# Altium project Orion_L1_SmashBoy.PrjPcb
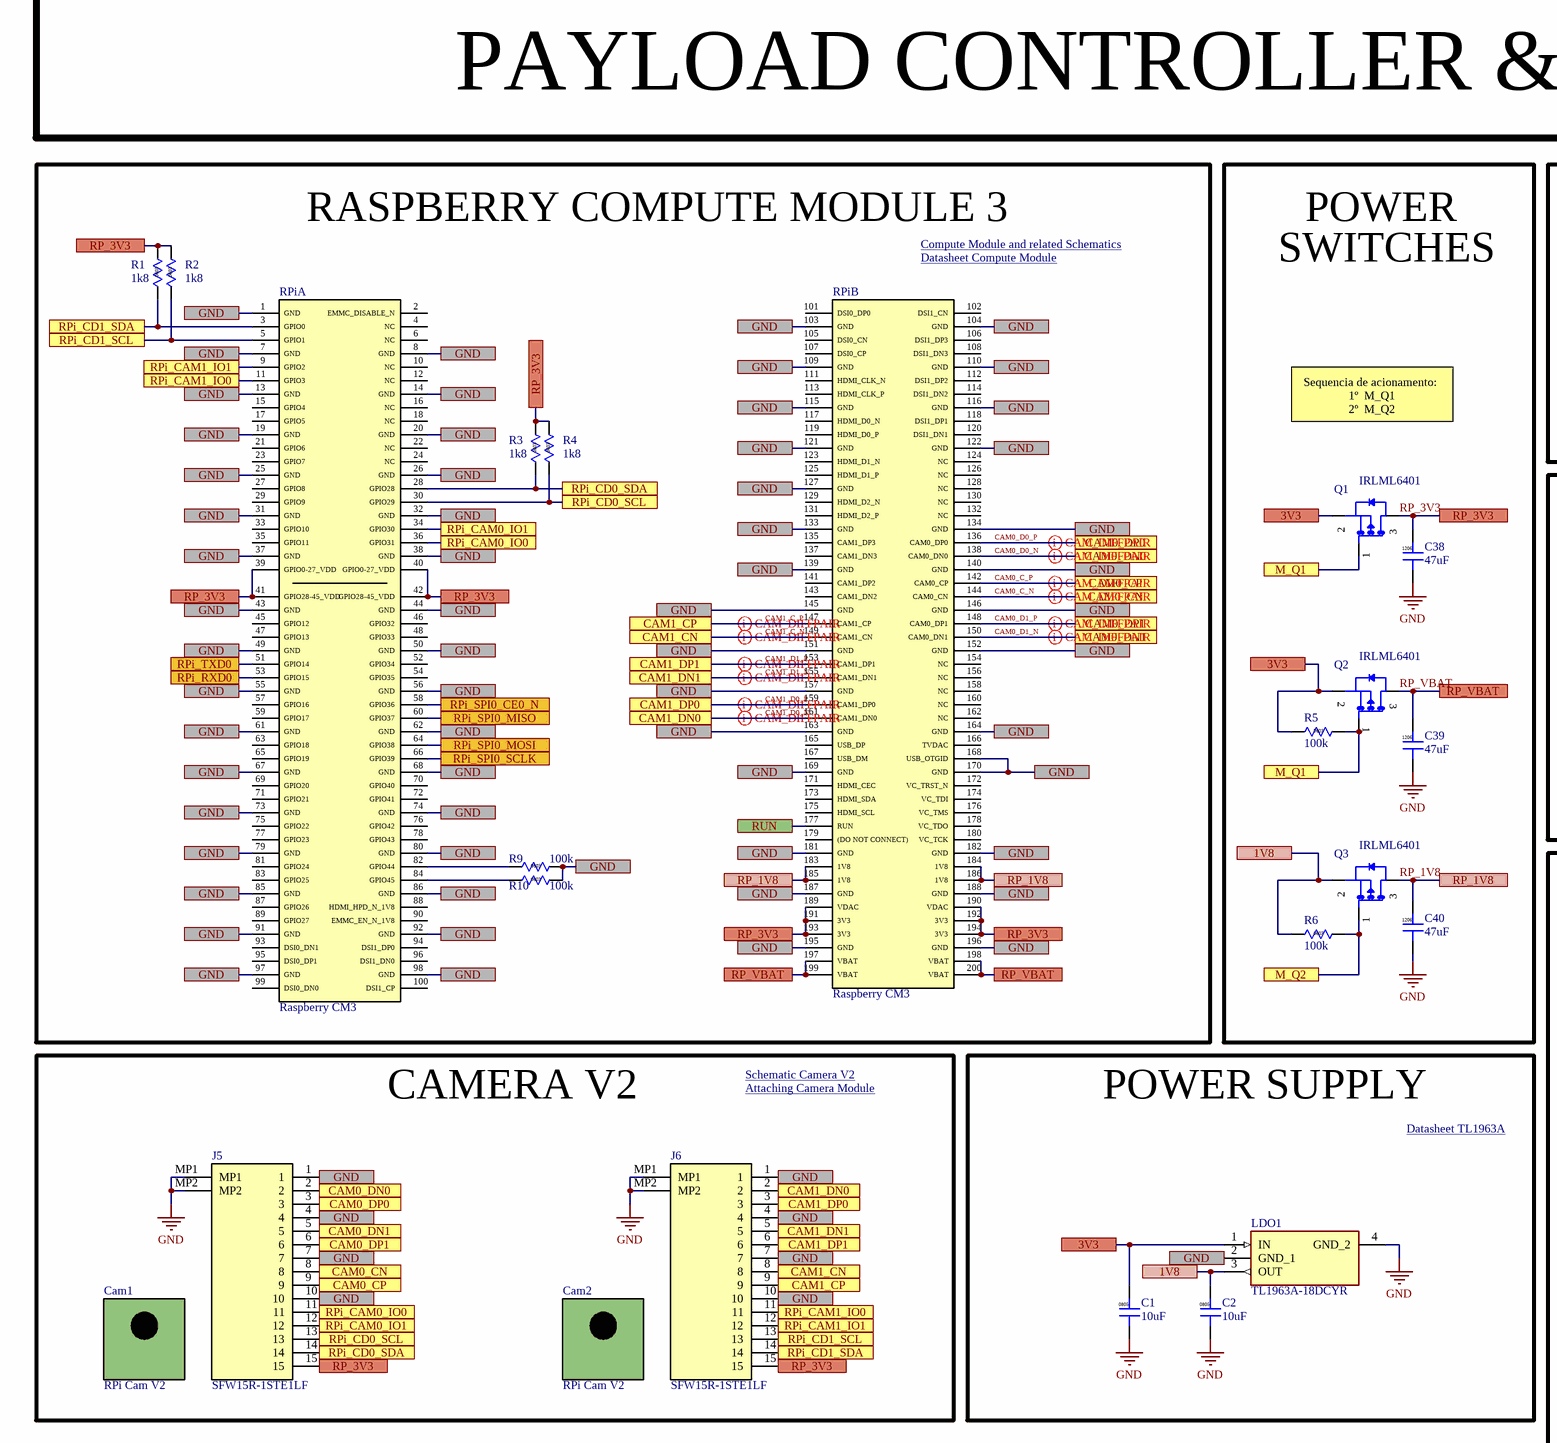
[diagram p0: L1_Smashboy_Sheet1.SchDoc, top left]
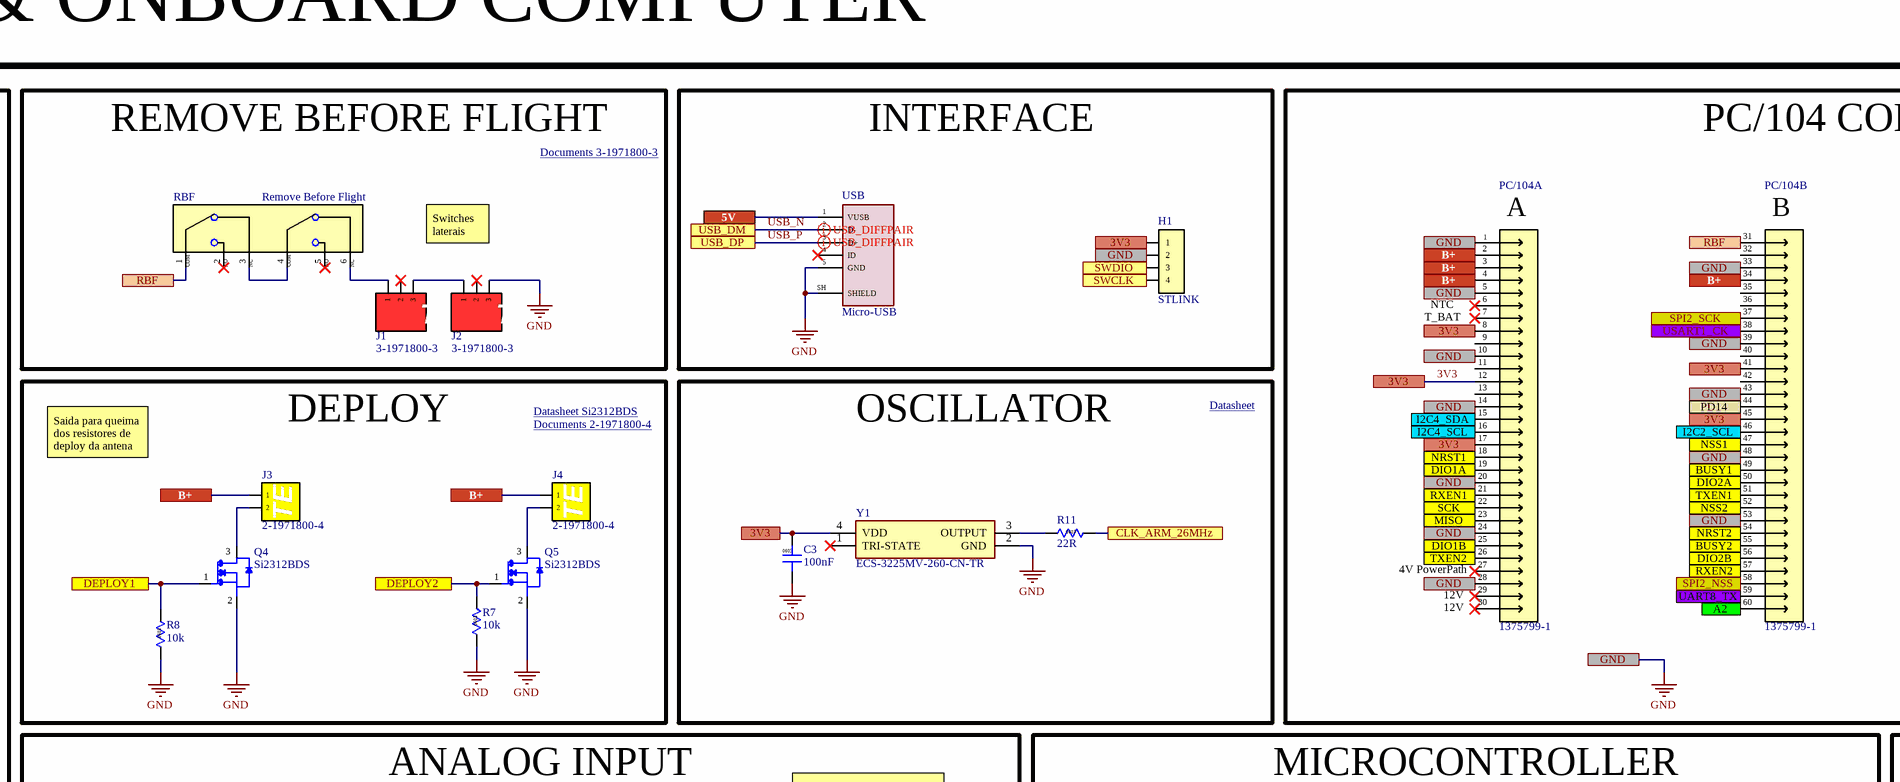
[diagram p1: L1_Smashboy_Sheet1.SchDoc, top middle]
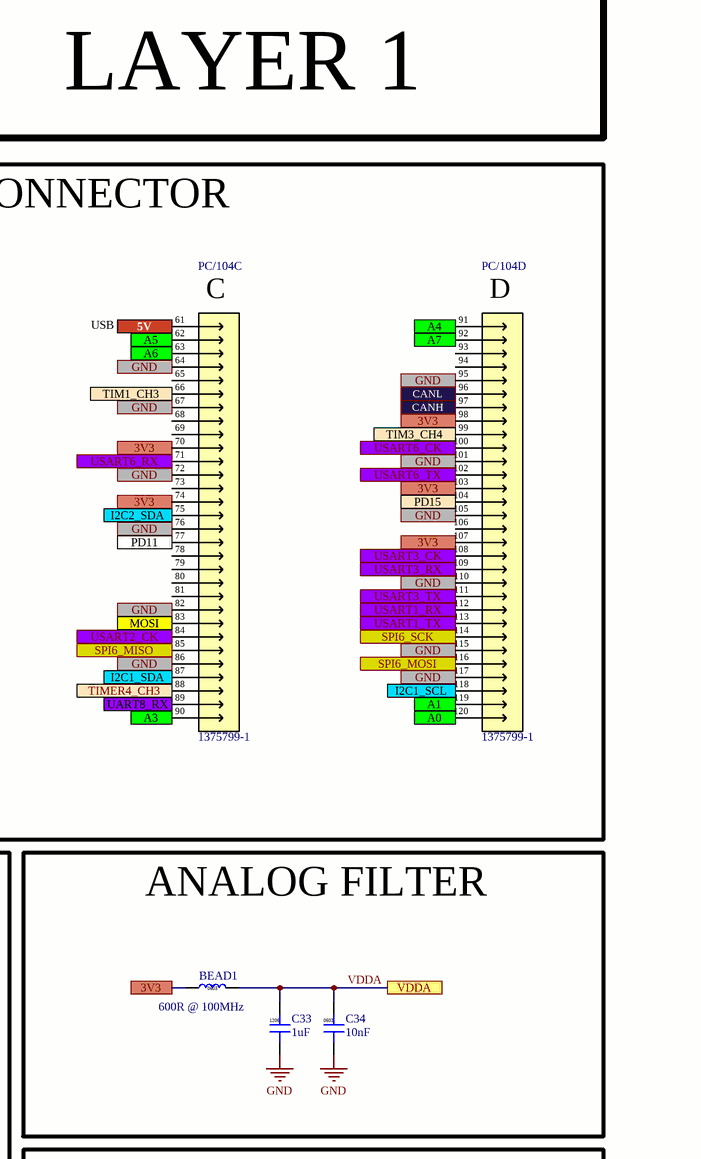
[diagram p2: L1_Smashboy_Sheet1.SchDoc, top right]
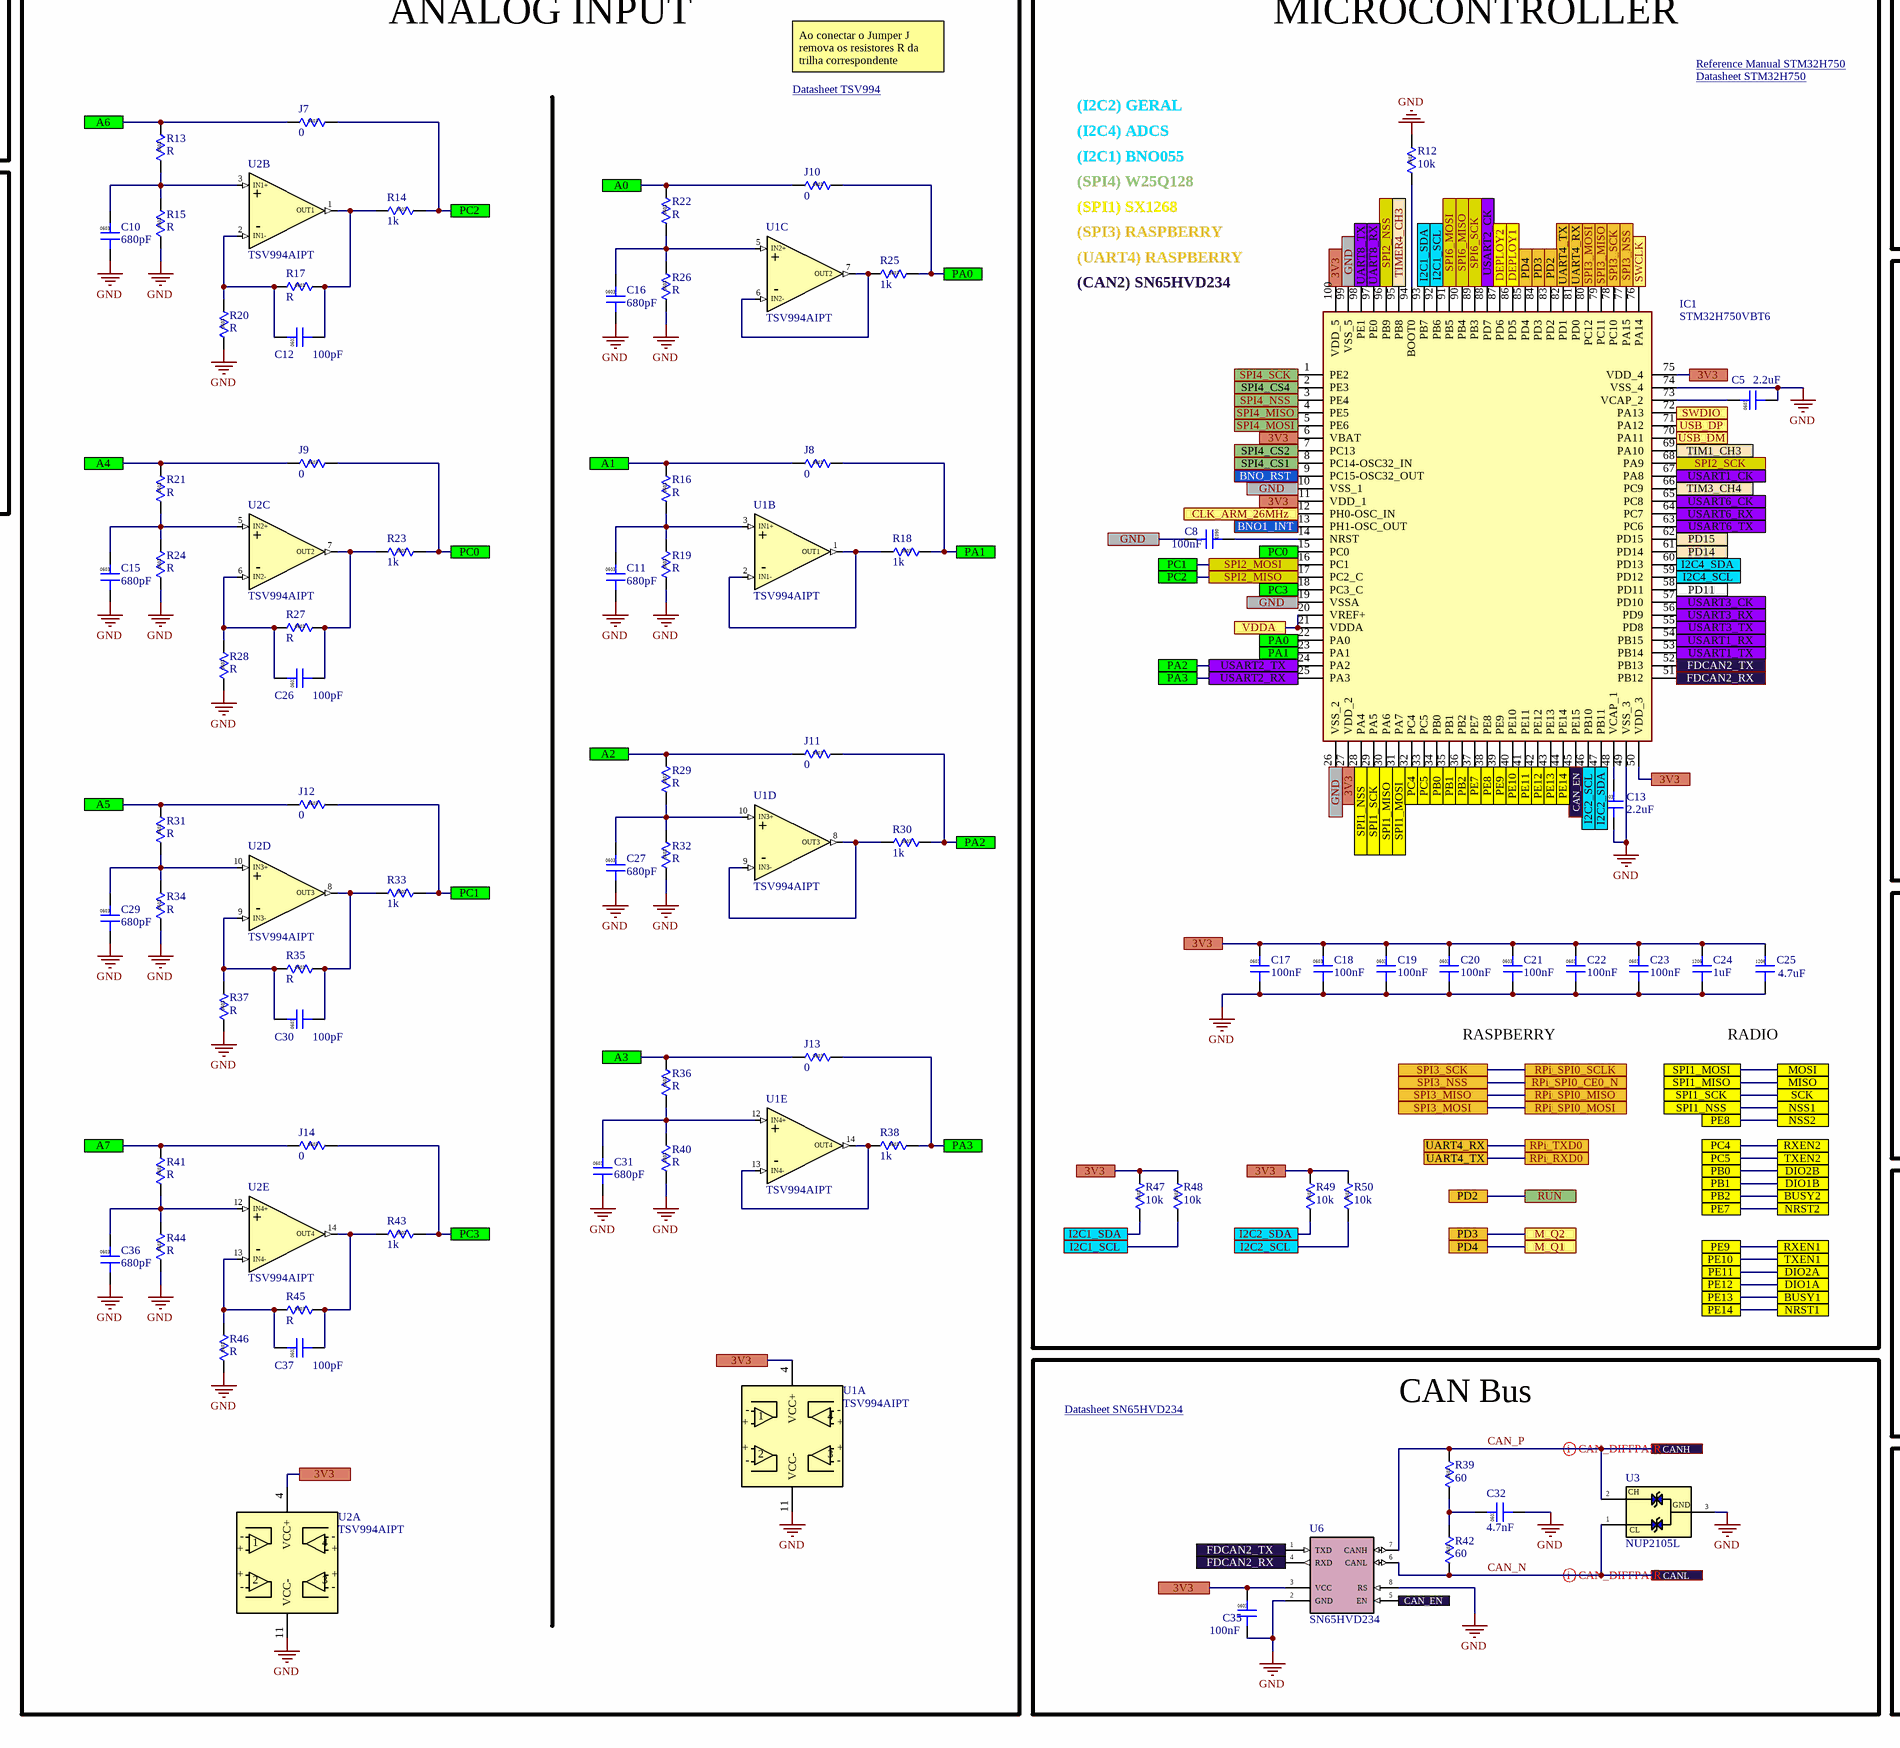
[diagram p3: L1_Smashboy_Sheet1.SchDoc, bottom middle]
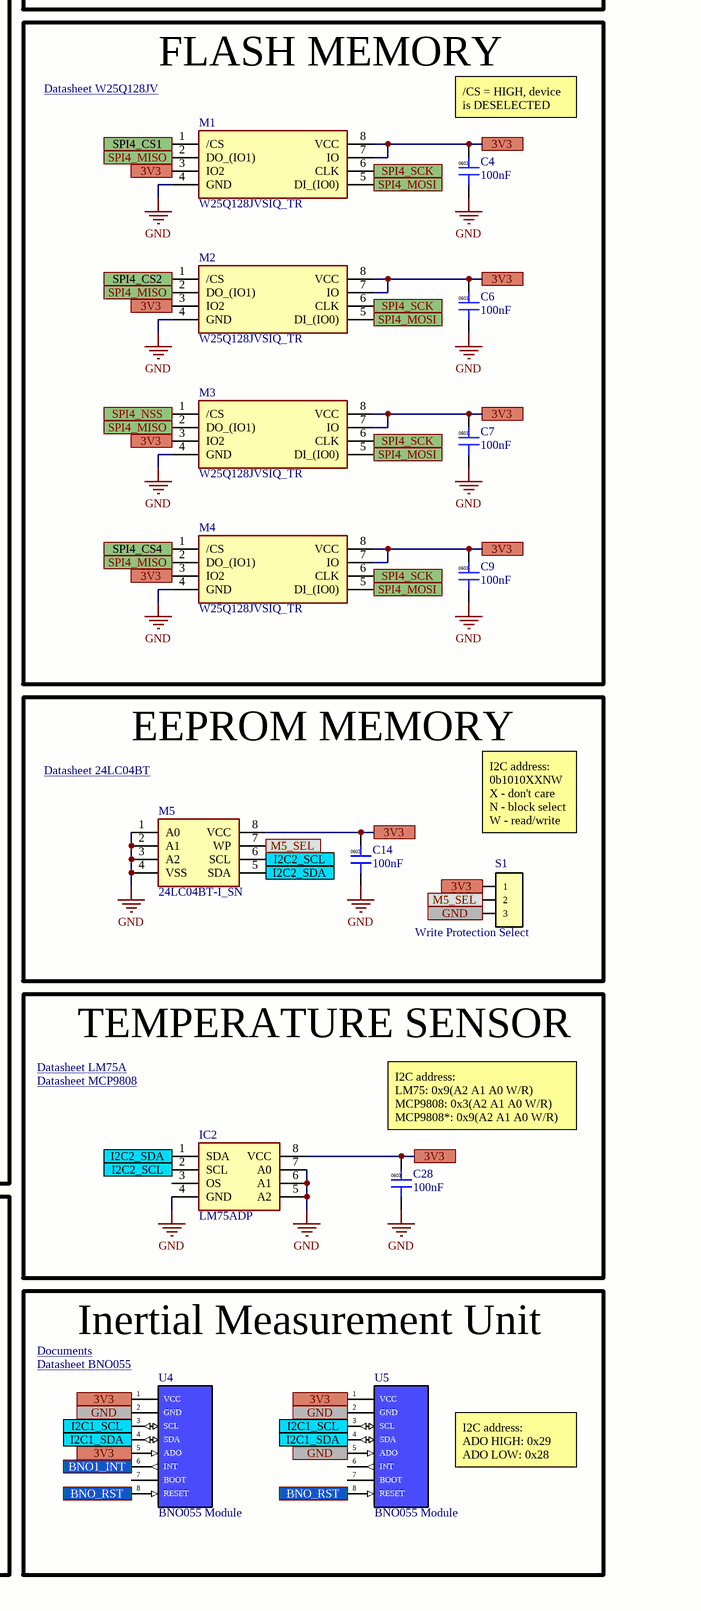
[diagram p4: L1_Smashboy_Sheet1.SchDoc, bottom right]
1 sheet, 133 parts. Net scope: flat (ports and power ports of the same name join across sheets).
Board file: L1_SmashBoy_PCB2.PcbDoc

## Sheet L1_Smashboy_Sheet1.SchDoc
size A1; SheetNumber: 1; SheetTotal: 1

### Parts
BEAD1  600R @ 100MHz  [IND0603]
C1  10uF  [CAP0805_085]
C2  10uF  [CAP0805_085]
C3  100nF  [CAP0603_060]
C4  100nF  [CAP0603_060]
C5  2.2uF  [CAP0603_060]
C6  100nF  [CAP0603_060]
C7  100nF  [CAP0603_060]
C8  100nF  [CAP0603_060]
C9  100nF  [CAP0603_060]
C10  680pF  [CAP0603_060]
C11  680pF  [CAP0603_060]
C12  100pF  [CAP0603_060]
C13  2.2uF  [CAP0603_060]
C14  100nF  [CAP0603_060]
C15  680pF  [CAP0603_060]
C16  680pF  [CAP0603_060]
C17  100nF  [CAP0603_060]
C18  100nF  [CAP0603_060]
C19  100nF  [CAP0603_060]
C20  100nF  [CAP0603_060]
C21  100nF  [CAP0603_060]
C22  100nF  [CAP0603_060]
C23  100nF  [CAP0603_060]
C24  1uF  [CAP1206_090]
C25  4.7uF  [CAP1206_090]
C26  100pF  [CAP0603_060]
C27  680pF  [CAP0603_060]
C28  100nF  [CAP0603_060]
C29  680pF  [CAP0603_060]
C30  100pF  [CAP0603_060]
C31  680pF  [CAP0603_060]
C32  4.7nF  [CAP0603_060]
C33  1uF  [CAP1206_090]
C34  10nF  [CAP0603_060]
C35  100nF  [CAP0603_060]
C36  680pF  [CAP0603_060]
C37  100pF  [CAP0603_060]
C38  47uF  [CAP1206_090]
C39  47uF  [CAP1206_090]
C40  47uF  [CAP1206_090]
Cam1  RPi Cam V2  [RPi_CAM_V2]
Cam2  RPi Cam V2  [RPi_CAM_V2]
H1  STLINK  [Header-4P-90]
IC1  STM32H750VBT6  [QFP50P1600X1600X160-100N]
IC2  LM75ADP  [SOP65P490X110-8N]
J1  3-1971800-3  [3-1971800-3]
J2  3-1971800-3  [3-1971800-3]
J3  2-1971800-4  [2-1971800-4]
J4  2-1971800-4  [2-1971800-4]
J5  SFW15R-1STE1LF  [SFW15R1STE1LF]
J6  SFW15R-1STE1LF  [SFW15R1STE1LF]
J7  0  [RES0603]
J8  0  [RES0603]
J9  0  [RES0603]
J10  0  [RES0603]
J11  0  [RES0603]
J12  0  [RES0603]
J13  0  [RES0603]
J14  0  [RES0603]
LDO1  TL1963A-18DCYR  [SOT230P700X180-4N]
M1  W25Q128JVSIQ_TR  [SOIC127P780X195-8N]
M2  W25Q128JVSIQ_TR  [SOIC127P780X195-8N]
M3  W25Q128JVSIQ_TR  [SOIC127P780X195-8N]
M4  W25Q128JVSIQ_TR  [SOIC127P780X195-8N]
M5  24LC04BT-I_SN  [SOIC127P600X175-8N]
PC/104  1375799-1  [1375799-1]  (parts A,B,C,D of 4)
Q1  IRLML6401  [SOT-23]
Q2  IRLML6401  [SOT-23]
Q3  IRLML6401  [SOT-23]
Q4  Si2312BDS  [SOT-23]
Q5  Si2312BDS  [SOT-23]
R1  1k8  [RES0603]
R2  1k8  [RES0603]
R3  1k8  [RES0603]
R4  1k8  [RES0603]
R5  100k  [RES0603]
R6  100k  [RES0603]
R7  10k  [RES0603]
R8  10k  [RES0603]
R9  100k  [RES0603]
R10  100k  [RES0603]
R11  22R  [RES0603]
R12  10k  [RES0603]
R13  R  [RES0603]
R14  1k  [RES0603]
R15  R  [RES0603]
R16  R  [RES0603]
R17  R  [RES0603]
R18  1k  [RES0603]
R19  R  [RES0603]
R20  R  [RES0603]
R21  R  [RES0603]
R22  R  [RES0603]
R23  1k  [RES0603]
R24  R  [RES0603]
R25  1k  [RES0603]
R26  R  [RES0603]
R27  R  [RES0603]
R28  R  [RES0603]
R29  R  [RES0603]
R30  1k  [RES0603]
R31  R  [RES0603]
R32  R  [RES0603]
R33  1k  [RES0603]
R34  R  [RES0603]
R35  R  [RES0603]
R36  R  [RES0603]
R37  R  [RES0603]
R38  1k  [RES0603]
R39  60  [RES0603]
R40  R  [RES0603]
R41  R  [RES0603]
R42  60  [RES0603]
R43  1k  [RES0603]
R44  R  [RES0603]
R45  R  [RES0603]
R46  R  [RES0603]
R47  10k  [RES0603]
R48  10k  [RES0603]
R49  10k  [RES0603]
R50  10k  [RES0603]
RBF  Remove Before Flight  [RBF]
RPi  Raspberry CM3  [RPi-CM3]  (parts A,B of 2)
S1  Write Protection Select  [Header-3P]
U1  TSV994AIPT  [SOP65P640X120-14N]  (parts A,B,C,D,E of 5)
U2  TSV994AIPT  [SOP65P640X120-14N]  (parts A,B,C,D,E of 5)
U3  NUP2105L  [SOT-23]
U4  BNO055 Module  [BNO055_M_TH]
U5  BNO055 Module  [BNO055_M_TH]
U6  SN65HVD234  [SOIC-8]
USB  Micro-USB  [MicroUSB]
Y1  ECS-3225MV-260-CN-TR  [ECS3225MVQ250CNTR]

### Blocks framed on the sheet
RASPBERRY COMPUTE MODULE 3: R1-R4 R9 R10 RPi
REMOVE BEFORE FLIGHT: J1 J2 RBF
INTERFACE: H1 USB
PC/104 CONNECTOR: PC/104
DEPLOY: J3 J4 Q4 Q5 R7 R8
OSCILLATOR: C3 R11 Y1
ANALOG INPUT: C10-C12 C15 C16 C26 C27 C29-C31 C36 C37 J7-J14 R13-R38 R40 R41 R43-R46 U1 U2
MICROCONTROLLER: C5 C8 C13 C17-C25 IC1 R12 R47-R50
ANALOG FILTER: BEAD1 C33 C34
CAMERA V2: Cam1 Cam2 J5 J6
POWER SUPPLY: C1 C2 LDO1
FLASH MEMORY: C4 C6 C7 C9 M1-M4
EEPROM MEMORY: C14 M5 S1
TEMPERATURE SENSOR: C28 IC2
CAN Bus: C32 C35 R39 R42 U3 U6
Inertial Measurement Unit: U4 U5

### Ports
1V8, 3V3, 5V, A0, A1, A2, A3, A4, A5, A6, A7, B+, BNO1_INT, BNO_RST, BUSY1, BUSY2, CAM0_CN, CAM0_CP, CAM0_DN0, CAM0_DN1, CAM0_DP0, CAM0_DP1, CAM1_CN, CAM1_CP, CAM1_DN0, CAM1_DN1, CAM1_DP0, CAM1_DP1, CAN_EN, CANH, CANL, CLK_ARM_26MHz, DEPLOY1, DEPLOY2, DIO1A, DIO1B, DIO2A, DIO2B, FDCAN2_RX, FDCAN2_TX, GND, I2C1_SCL, I2C1_SDA, I2C2_SCL, I2C2_SDA, I2C4_SCL, I2C4_SDA, M5_SEL, M_Q1, M_Q2, MISO, MOSI, NRST1, NRST2, NSS1, NSS2, PA0, PA1, PA2, PA3, PB0, PB1, PB2, PC0, PC1, PC2, PC3, PC4, PC5, PD2, PD3, PD4, PD11, PD14, PD15, PE7, PE8, PE9, PE10, PE11, PE12, PE13, PE14, RBF, RP_1V8, RP_3V3, RP_VBAT, RPi_CAM0_IO0, RPi_CAM0_IO1, RPi_CAM1_IO0, RPi_CAM1_IO1, RPi_CD0_SCL, RPi_CD0_SDA, RPi_CD1_SCL, RPi_CD1_SDA, RPi_RXD0, RPi_SPI0_CE0_N, RPi_SPI0_MISO, RPi_SPI0_MOSI, RPi_SPI0_SCLK, RPi_TXD0, RUN, RXEN1, RXEN2, SCK, SPI1_MISO, SPI1_MOSI, SPI1_NSS, SPI1_SCK, SPI2_MISO, SPI2_MOSI, SPI2_NSS, SPI2_SCK, SPI3_MISO, SPI3_MOSI, SPI3_NSS, SPI3_SCK, SPI4_CS1, SPI4_CS2, SPI4_CS4, SPI4_MISO, SPI4_MOSI, SPI4_NSS, SPI4_SCK, SPI6_MISO, SPI6_MOSI, SPI6_SCK, SWCLK, SWDIO, TIM1_CH3, TIM3_CH4, TIMER4_CH3, TXEN1, TXEN2, UART4_RX, UART4_TX, UART8_RX, UART8_TX, USART1_CK, USART1_RX, USART1_TX, USART2_CK, USART2_RX, USART2_TX, USART3_CK, USART3_RX, USART3_TX, USART6_CK, USART6_RX, USART6_TX, USB_DM, USB_DP, VDDA

### Nets
GND: C1.2 C2.2 C3.2 C4.2 C5.2 C6.2 C7.2 C8.2 C9.2 C10.2 C11.2 C13.2 C14.2 C15.2 C16.2 C17.2 C18.2 C19.2 C20.2 C21.2 C22.2 C23.2 C24.2 C25.2 C27.2 C28.2 C29.2 C31.2 C32.2 C33.2 C34.2 C35.2 C36.2 C38.2 C39.2 C40.2 H1.2 IC1.10(VSS_1) IC1.19(VSSA) IC1.26(VSS_2) IC1.49(VSS_3) IC1.74(VSS_4) IC1.99(VSS_5) IC2.4(GND) IC2.5(A2) IC2.6(A1) IC2.7(A0) J2.3 J5.1 J5.4 J5.7 J5.10 J5.MP1 J5.MP2 J6.1 J6.4 J6.7 J6.10 J6.MP1 J6.MP2 LDO1.2(GND_1) LDO1.4(GND_2) M1.4(GND) M2.4(GND) M3.4(GND) M4.4(GND) M5.1(A0) M5.2(A1) M5.3(A2) M5.4(VSS) PC/104.1 PC/104.5 PC/104.10 PC/104.14 PC/104.20 PC/104.24 PC/104.28 PC/104.33 PC/104.39 PC/104.43 PC/104.48 PC/104.53 PC/104.64 PC/104.67 PC/104.72 PC/104.76 PC/104.82 PC/104.86 PC/104.95 PC/104.101 PC/104.105 PC/104.110 PC/104.115 PC/104.117 Q4.2 Q5.2 R7.1 R8.1 R9.2 R10.2 R12.2 R15.1 R19.1 R20.1 R24.1 R26.1 R28.1 R32.1 R34.1 R37.1 R40.1 R44.1 R46.1 RPi.1(GND) RPi.7(GND) RPi.8(GND) RPi.13(GND) RPi.14(GND) RPi.19(GND) RPi.20(GND) RPi.25(GND) RPi.26(GND) RPi.31(GND) RPi.32(GND) RPi.37(GND) RPi.38(GND) RPi.43(GND) RPi.44(GND) RPi.49(GND) RPi.50(GND) RPi.55(GND) RPi.56(GND) RPi.61(GND) RPi.62(GND) RPi.67(GND) RPi.68(GND) RPi.73(GND) RPi.74(GND) RPi.79(GND) RPi.80(GND) RPi.85(GND) RPi.86(GND) RPi.91(GND) RPi.92(GND) RPi.97(GND) RPi.98(GND) RPi.103(GND) RPi.104(GND) RPi.109(GND) RPi.110(GND) RPi.115(GND) RPi.116(GND) RPi.121(GND) RPi.122(GND) RPi.127(GND) RPi.133(GND) RPi.134(GND) RPi.139(GND) RPi.140(GND) RPi.145(GND) RPi.146(GND) RPi.151(GND) RPi.152(GND) RPi.157(GND) RPi.163(GND) RPi.164(GND) RPi.168(USB_OTGID) RPi.169(GND) RPi.170(GND) RPi.181(GND) RPi.182(GND) RPi.187(GND) RPi.188(GND) RPi.195(GND) RPi.196(GND) S1.3 U1.11(VCC-) U2.11(VCC-) U3.3(GND) U4.2(GND) U5.2(GND) U5.5(ADO) U6.2(GND) U6.8(RS) USB.5(GND) USB.SH(SHIELD) Y1.2(GND) ; port GND
3V3: BEAD1.1 C1.1 C3.1 C4.1 C6.1 C7.1 C9.1 C14.1 C17.1 C18.1 C19.1 C20.1 C21.1 C22.1 C23.1 C24.1 C25.1 C28.1 C35.1 H1.1 IC1.6(VBAT) IC1.11(VDD_1) IC1.27(VDD_2) IC1.50(VDD_3) IC1.75(VDD_4) IC1.100(VDD_5) IC2.8(VCC) LDO1.1(IN) M1.3(IO2) M1.7(IO) M1.8(VCC) M2.3(IO2) M2.7(IO) M2.8(VCC) M3.3(IO2) M3.7(IO) M3.8(VCC) M4.3(IO2) M4.7(IO) M4.8(VCC) M5.8(VCC) PC/104.8 PC/104.12 PC/104.17 PC/104.41 PC/104.45 PC/104.70 PC/104.74 PC/104.98 PC/104.103 PC/104.107 Q1.2 Q2.2 R5.1 R47.2 R48.2 R49.2 R50.2 S1.1 U1.4(VCC+) U2.4(VCC+) U4.1(VCC) U4.5(ADO) U5.1(VCC) U6.3(VCC) Y1.4(VDD) ; port 3V3
CAM0_C_N: J5.8 RPi.144(CAM0_CN) ; port CAM0_CN
CAM0_C_P: J5.9 RPi.142(CAM0_CP) ; port CAM0_CP
CAM0_D0_N: J5.2 RPi.138(CAM0_DN0) ; port CAM0_DN0
CAM0_D0_P: J5.3 RPi.136(CAM0_DP0) ; port CAM0_DP0
CAM0_D1_N: J5.5 RPi.150(CAM0_DN1) ; port CAM0_DN1
CAM0_D1_P: J5.6 RPi.148(CAM0_DP1) ; port CAM0_DP1
CAM1_C_N: J6.8 RPi.149(CAM1_CN) ; port CAM1_CN
CAM1_C_P: J6.9 RPi.147(CAM1_CP) ; port CAM1_CP
CAM1_D0_N: J6.2 RPi.161(CAM1_DN0) ; port CAM1_DN0
CAM1_D0_P: J6.3 RPi.159(CAM1_DP0) ; port CAM1_DP0
CAM1_D1_N: J6.5 RPi.155(CAM1_DN1) ; port CAM1_DN1
CAM1_D1_P: J6.6 RPi.153(CAM1_DP1) ; port CAM1_DP1
CAN_N: PC/104.96 R42.1 U3.1(CL) U6.6(CANL) ; port CANL
CAN_P: PC/104.97 R39.2 U3.2(CH) U6.7(CANH) ; port CANH
RP_1V8: C40.1 Q3.3 RPi.183(1V8) RPi.184(1V8) RPi.185(1V8) RPi.186(1V8) ; port RP_1V8
RP_3V3: C38.1 J5.15 J6.15 Q1.3 R1.2 R2.2 R3.2 R4.2 RPi.39(GPIO0-27_VDD) RPi.40(GPIO0-27_VDD) RPi.41(GPIO28-45_VDD) RPi.42(GPIO28-45_VDD) RPi.189(VDAC) RPi.190(VDAC) RPi.191(3V3) RPi.192(3V3) RPi.193(3V3) RPi.194(3V3) ; port RP_3V3
RP_VBAT: C39.1 Q2.3 RPi.197(VBAT) RPi.198(VBAT) RPi.199(VBAT) RPi.200(VBAT) ; port RP_VBAT
USB_N: IC1.70(PA11) USB.2(D-) ; port USB_DM
USB_P: IC1.71(PA12) USB.3(D+) ; port USB_DP
VDDA: BEAD1.2 C33.1 C34.1 IC1.20(VREF+) IC1.21(VDDA) ; port VDDA
NetC2_1: C2.1 LDO1.3(OUT) Q3.2 R6.1 ; port 1V8
NetC5_1: C5.1 IC1.73(VCAP_2)
NetC8_1: C8.1 IC1.14(NRST)
NetC10_1: C10.1 R13.1 R15.2 U2.3(IN1+)
NetC11_1: C11.1 R16.1 R19.2 U1.3(IN1+)
NetC12_1: C12.1 R17.1 R20.2 U2.2(IN1-)
NetC12_2: C12.2 R14.1 R17.2 U2.1(OUT1)
NetC13_1: C13.1 IC1.48(VCAP_1)
NetC15_1: C15.1 R21.1 R24.2 U2.5(IN2+)
NetC16_1: C16.1 R22.1 R26.2 U1.5(IN2+)
NetC26_1: C26.1 R27.1 R28.2 U2.6(IN2-)
NetC26_2: C26.2 R23.1 R27.2 U2.7(OUT2)
NetC27_1: C27.1 R29.1 R32.2 U1.10(IN3+)
NetC29_1: C29.1 R31.1 R34.2 U2.10(IN3+)
NetC30_1: C30.1 R35.1 R37.2 U2.9(IN3-)
NetC30_2: C30.2 R33.1 R35.2 U2.8(OUT3)
NetC31_1: C31.1 R36.1 R40.2 U1.12(IN4+)
NetC32_1: C32.1 R39.1 R42.2
NetC36_1: C36.1 R41.1 R44.2 U2.12(IN4+)
NetC37_1: C37.1 R45.1 R46.2 U2.13(IN4-)
NetC37_2: C37.2 R43.1 R45.2 U2.14(OUT4)
NetH1_3: H1.3 IC1.72(PA13) ; port SWDIO
NetH1_4: H1.4 IC1.76(PA14) ; port SWCLK
NetIC1_1: IC1.1(PE2) M1.6(CLK) M2.6(CLK) M3.6(CLK) M4.6(CLK) ; port SPI4_SCK
NetIC1_2: IC1.2(PE3) M4.1(/CS) ; port SPI4_CS4
NetIC1_3: IC1.3(PE4) M3.1(/CS) ; port SPI4_NSS
NetIC1_4: IC1.4(PE5) M1.2(DO_(IO1)) M2.2(DO_(IO1)) M3.2(DO_(IO1)) M4.2(DO_(IO1)) ; port SPI4_MISO
NetIC1_5: IC1.5(PE6) M1.5(DI_(IO0)) M2.5(DI_(IO0)) M3.5(DI_(IO0)) M4.5(DI_(IO0)) ; port SPI4_MOSI
NetIC1_7: IC1.7(PC13) M2.1(/CS) ; port SPI4_CS2
NetIC1_8: IC1.8(PC14-OSC32_IN) M1.1(/CS) ; port SPI4_CS1
NetIC1_9: IC1.9(PC15-OSC32_OUT) U4.8(RESET) U5.8(RESET) ; port BNO_RST
NetIC1_12: IC1.12(PH0-OSC_IN) R11.2 ; port CLK_ARM_26MHz
NetIC1_13: IC1.13(PH1-OSC_OUT) U4.6(INT) ; port BNO1_INT
NetIC1_15: IC1.15(PC0) J9.2 R23.2 ; port PC0
NetIC1_16: IC1.16(PC1) J12.2 R33.2 ; port SPI2_MOSI, port PC1
NetIC1_17: IC1.17(PC2_C) J7.2 R14.2 ; port SPI2_MISO, port PC2
NetIC1_18: IC1.18(PC3_C) J14.2 R43.2 ; port PC3
NetIC1_22: IC1.22(PA0) J10.2 R25.2 ; port PA0
NetIC1_23: IC1.23(PA1) J8.2 R18.2 ; port PA1
NetIC1_24: IC1.24(PA2) J11.2 R30.2 ; port USART2_TX, port PA2
NetIC1_25: IC1.25(PA3) J13.2 R38.2 ; port USART2_RX, port PA3
NetIC1_28: IC1.28(PA4) PC/104.47 ; port SPI1_NSS, port NSS1
NetIC1_29: IC1.29(PA5) PC/104.22 ; port SPI1_SCK, port SCK
NetIC1_30: IC1.30(PA6) PC/104.23 ; port SPI1_MISO, port MISO
NetIC1_31: IC1.31(PA7) PC/104.83 ; port SPI1_MOSI, port MOSI
NetIC1_32: IC1.32(PC4) PC/104.57 ; port PC4, port RXEN2
NetIC1_33: IC1.33(PC5) PC/104.26 ; port TXEN2, port PC5
NetIC1_34: IC1.34(PB0) PC/104.56 ; port DIO2B, port PB0
NetIC1_35: IC1.35(PB1) PC/104.25 ; port DIO1B, port PB1
NetIC1_36: IC1.36(PB2) PC/104.55 ; port BUSY2, port PB2
NetIC1_37: IC1.37(PE7) PC/104.54 ; port NRST2, port PE7
NetIC1_38: IC1.38(PE8) PC/104.52 ; port NSS2, port PE8
NetIC1_39: IC1.39(PE9) PC/104.21 ; port RXEN1, port PE9
NetIC1_40: IC1.40(PE10) PC/104.51 ; port TXEN1, port PE10
NetIC1_41: IC1.41(PE11) PC/104.50 ; port DIO2A, port PE11
NetIC1_42: IC1.42(PE12) PC/104.19 ; port DIO1A, port PE12
NetIC1_43: IC1.43(PE13) PC/104.49 ; port BUSY1, port PE13
NetIC1_44: IC1.44(PE14) PC/104.18 ; port NRST1, port PE14
NetIC1_45: IC1.45(PE15) U6.5(EN) ; port CAN_EN
NetIC1_46: IC1.46(PB10) IC2.2(SCL) M5.6(SCL) PC/104.46 R50.1 ; port I2C2_SCL
NetIC1_47: IC1.47(PB11) IC2.1(SDA) M5.5(SDA) PC/104.75 R49.1 ; port I2C2_SDA
NetIC1_51: IC1.51(PB12) U6.4(RXD) ; port FDCAN2_RX
NetIC1_52: IC1.52(PB13) U6.1(TXD) ; port FDCAN2_TX
NetIC1_53: IC1.53(PB14) PC/104.113 ; port USART1_TX
NetIC1_54: IC1.54(PB15) PC/104.112 ; port USART1_RX
NetIC1_55: IC1.55(PD8) PC/104.111 ; port USART3_TX
NetIC1_56: IC1.56(PD9) PC/104.109 ; port USART3_RX
NetIC1_57: IC1.57(PD10) PC/104.108 ; port USART3_CK
NetIC1_58: IC1.58(PD11) PC/104.77 ; port PD11
NetIC1_59: IC1.59(PD12) PC/104.16 ; port I2C4_SCL
NetIC1_60: IC1.60(PD13) PC/104.15 ; port I2C4_SDA
NetIC1_61: IC1.61(PD14) PC/104.44 ; port PD14
NetIC1_62: IC1.62(PD15) PC/104.104 ; port PD15
NetIC1_63: IC1.63(PC6) PC/104.102 ; port USART6_TX
NetIC1_64: IC1.64(PC7) PC/104.71 ; port USART6_RX
NetIC1_65: IC1.65(PC8) PC/104.100 ; port USART6_CK
NetIC1_66: IC1.66(PC9) PC/104.99 ; port TIM3_CH4
NetIC1_67: IC1.67(PA8) PC/104.38 ; port USART1_CK
NetIC1_68: IC1.68(PA9) PC/104.37 ; port SPI2_SCK
NetIC1_69: IC1.69(PA10) PC/104.66 ; port TIM1_CH3
NetIC1_77: IC1.77(PA15) RPi.58(GPIO36) ; port SPI3_NSS, port RPi_SPI0_CE0_N
NetIC1_78: IC1.78(PC10) RPi.66(GPIO39) ; port SPI3_SCK, port RPi_SPI0_SCLK
NetIC1_79: IC1.79(PC11) RPi.60(GPIO37) ; port SPI3_MISO, port RPi_SPI0_MISO
NetIC1_80: IC1.80(PC12) RPi.64(GPIO38) ; port SPI3_MOSI, port RPi_SPI0_MOSI
NetIC1_81: IC1.81(PD0) RPi.51(GPIO14) ; port RPi_TXD0, port UART4_RX
NetIC1_82: IC1.82(PD1) RPi.53(GPIO15) ; port RPi_RXD0, port UART4_TX
NetIC1_83: IC1.83(PD2) RPi.177(RUN) ; port RUN, port PD2
NetIC1_84: IC1.84(PD3) Q3.1 R6.2 ; port M_Q2, port PD3
NetIC1_85: IC1.85(PD4) Q1.1 Q2.1 R5.2 ; port M_Q1, port PD4
NetIC1_86: IC1.86(PD5) Q4.1 R8.2 ; port DEPLOY1
NetIC1_87: IC1.87(PD6) Q5.1 R7.2 ; port DEPLOY2
NetIC1_88: IC1.88(PD7) PC/104.84 ; port USART2_CK
NetIC1_89: IC1.89(PB3) PC/104.114 ; port SPI6_SCK
NetIC1_90: IC1.90(PB4) PC/104.85 ; port SPI6_MISO
NetIC1_91: IC1.91(PB5) PC/104.116 ; port SPI6_MOSI
NetIC1_92: IC1.92(PB6) PC/104.118 R48.1 U4.3(SCL) U5.3(SCL) ; port I2C1_SCL
NetIC1_93: IC1.93(PB7) PC/104.87 R47.1 U4.4(SDA) U5.4(SDA) ; port I2C1_SDA
NetIC1_94: IC1.94(BOOT0) R12.1
NetIC1_95: IC1.95(PB8) PC/104.88 ; port TIMER4_CH3
NetIC1_96: IC1.96(PB9) PC/104.58 ; port SPI2_NSS
NetIC1_97: IC1.97(PE0) PC/104.89 ; port UART8_RX
NetIC1_98: IC1.98(PE1) PC/104.59 ; port UART8_TX
NetJ1_1: J1.1 RBF.6
NetJ1_3: J1.3 J2.1
NetJ3_1: J3.1 J4.1 PC/104.2 PC/104.3 PC/104.4 PC/104.34 ; port B+
NetJ3_2: J3.2 Q4.3
NetJ4_2: J4.2 Q5.3
NetJ5_11: J5.11 RPi.36(GPIO31) ; port RPi_CAM0_IO0
NetJ5_12: J5.12 RPi.34(GPIO30) ; port RPi_CAM0_IO1
NetJ5_13: J5.13 R4.1 RPi.30(GPIO29) ; port RPi_CD0_SCL
NetJ5_14: J5.14 R3.1 RPi.28(GPIO28) ; port RPi_CD0_SDA
NetJ6_11: J6.11 RPi.11(GPIO3) ; port RPi_CAM1_IO0
NetJ6_12: J6.12 RPi.9(GPIO2) ; port RPi_CAM1_IO1
NetJ6_13: J6.13 R2.1 RPi.5(GPIO1) ; port RPi_CD1_SCL
NetJ6_14: J6.14 R1.1 RPi.3(GPIO0) ; port RPi_CD1_SDA
NetJ7_1: J7.1 PC/104.63 R13.2 ; port A6
NetJ8_1: J8.1 PC/104.119 R16.2 ; port A1
NetJ9_1: J9.1 PC/104.91 R21.2 ; port A4
NetJ10_1: J10.1 PC/104.120 R22.2 ; port A0
NetJ11_1: J11.1 PC/104.60 R29.2 ; port A2
NetJ12_1: J12.1 PC/104.62 R31.2 ; port A5
NetJ13_1: J13.1 PC/104.90 R36.2 ; port A3
NetJ14_1: J14.1 PC/104.92 R41.2 ; port A7
NetM5_7: M5.7(WP) S1.2 ; port M5_SEL
NetPC/104_31: PC/104.31 RBF.1 ; port RBF
NetPC/104_61: PC/104.61 USB.1(VUSB) ; port 5V
NetR9_1: R9.1 RPi.82(GPIO44)
NetR10_1: R10.1 RPi.84(GPIO45)
NetR11_1: R11.1 Y1.3(OUTPUT)
NetR18_1: R18.1 U1.1(OUT1) U1.2(IN1-)
NetR25_1: R25.1 U1.6(IN2-) U1.7(OUT2)
NetR30_1: R30.1 U1.8(OUT3) U1.9(IN3-)
NetR38_1: R38.1 U1.13(IN4-) U1.14(OUT4)
NetRBF_3: RBF.3 RBF.4

Not connected (* = marked no-connect by the designer): IC2 3(OS); J1 2*; J2 2*; PC/104 6* 7* 9 11 13 27* 29* 30* 32 35 36 40 42 65 68 69 73 78 79 80 81 93 94 106; RBF 2* 5*; RPi 2(EMMC_DISABLE_N) 4(NC) 6(NC) 10(NC) 12(NC) 15(GPIO4) 16(NC) 17(GPIO5) 18(NC) 21(GPIO6) 22(NC) 23(GPIO7) 24(NC) 27(GPIO8) 29(GPIO9) 33(GPIO10) 35(GPIO11) 45(GPIO12) 46(GPIO32) 47(GPIO13) 48(GPIO33) 52(GPIO34) 54(GPIO35) 57(GPIO16) 59(GPIO17) 63(GPIO18) 65(GPIO19) 69(GPIO20) 70(GPIO40) 71(GPIO21) 72(GPIO41) 75(GPIO22) 76(GPIO42) 77(GPIO23) 78(GPIO43) 81(GPIO24) 83(GPIO25) 87(GPIO26) 88(HDMI_HPD_N_1V8) 89(GPIO27) 90(EMMC_EN_N_1V8) 93(DSI0_DN1) 94(DSI1_DP0) 95(DSI0_DP1) 96(DSI1_DN0) 99(DSI0_DN0) 100(DSI1_CP) 101(DSI0_DP0) 102(DSI1_CN) 105(DSI0_CN) 106(DSI1_DP3) 107(DSI0_CP) 108(DSI1_DN3) 111(HDMI_CLK_N) 112(DSI1_DP2) 113(HDMI_CLK_P) 114(DSI1_DN2) 117(HDMI_D0_N) 118(DSI1_DP1) 119(HDMI_D0_P) 120(DSI1_DN1) 123(HDMI_D1_N) 124(NC) 125(HDMI_D1_P) 126(NC) 128(NC) 129(HDMI_D2_N) 130(NC) 131(HDMI_D2_P) 132(NC) 135(CAM1_DP3) 137(CAM1_DN3) 141(CAM1_DP2) 143(CAM1_DN2) 154(NC) 156(NC) 158(NC) 160(NC) 162(NC) 165(USB_DP) 166(TVDAC) 167(USB_DM) 171(HDMI_CEC) 172(VC_TRST_N) 173(HDMI_SDA) 174(VC_TDI) 175(HDMI_SCL) 176(VC_TMS) 178(VC_TDO) 179((DO_NOT_CONNECT)) 180(VC_TCK); U4 7(BOOT); U5 6(INT) 7(BOOT); USB 4(ID)*; Y1 1(TRI-STATE)*

### Layout directives
differential pair; differential pair class Camera: CAM0_C_N, CAM0_C_P, CAM0_D0_N, CAM0_D0_P, CAM0_D1_N, CAM0_D1_P, CAM1_C_N, CAM1_D0_N, CAM1_D0_P, CAM1_D1_N, CAM1_D1_P
differential pair; differential pair; differential pair class Camera: CAM1_C_P
differential pair; differential pair class USB: USB_N, USB_P
differential pair; differential pair class CAN_BUS: CAN_N, CAN_P

### Notes on the sheet
- PAYLOAD CONTROLLER & ONBOARD COMPUTER
- LAYER 1
- POWER
- Documents 3-1971800-3 <https://www.te.com/usa-en/product-3-1971800-3.html>
- Compute Module and related Schematics <https://www.raspberrypi.org/documentation/hardware/computemodule/schematics.md>
- (near RPi) Datasheet Compute Module <https://www.raspberrypi.org/documentation/hardware/computemodule/datasheets/rpi_DATA_CM_1p0.pdf>
- SWITCHES
- Switches laterais
- USB
- Sequencia de acionamento:
  1º  M_Q1
  2º  M_Q2
- (near PC/104) T_BAT
- NTC
- Datasheet <https://ecsxtal.com/store/pdf/ECS-3225MV.pdf>
- Saida para queima dos resistores de deploy da antena
- Datasheet Si2312BDS <https://www.vishay.com/docs/73235/si2312bds.pdf>
- Documents 2-1971800-4 <https://www.te.com/usa-en/product-2-1971800-4.html>
- (near PC/104) 4V PowerPath
- (near PC/104) 12V
- Datasheet TSV994 <https://www.st.com/resource/en/datasheet/tsv991.pdf>
- Ao conectar o Jumper J remova os resistores R da trilha correspondente
- Datasheet STM32H750 <https://www.st.com/resource/en/datasheet/stm32h750ib.pdf>
- Reference Manual STM32H750 <https://www.st.com/resource/en/reference_manual/dm00314099-stm32h742-stm32h743753-and-stm32h750-value-line-advanced-armbased-32bit-mcus-stmicroelectronics.pdf>
- (I2C1) BNO055
- (I2C4) ADCS
- (I2C2) GERAL
- Schematic Camera V2 <https://www.raspberrypi.org/documentation/hardware/camera/schematics/rpi_SCH_Camera2_2p1.pdf>
- Attaching Camera Module <https://www.raspberrypi.org/documentation/hardware/computemodule/cmio-camera.md>
- (SPI4) W25Q128
- (SPI1) SX1268
- Datasheet TL1963A <https://www.ti.com/lit/ds/symlink/tl1963a.pdf>
- (CAN2) SN65HVD234
- (SPI3) RASPBERRY
- (UART4) RASPBERRY
- Datasheet W25Q128JV <https://www.winbond.com/resource-files/w25q128jv%20revg%2004082019%20plus.pdf>
- (near C4) /CS = HIGH, device is DESELECTED
- Datasheet 24LC04BT <http://ww1.microchip.com/downloads/en/DeviceDoc/21708G.pdf>
- RASPBERRY
- RADIO
- I2C address:
  0b1010XXNW
  X - don't care
  N - block select
  W - read/write
- Datasheet LM75A <https://www.nxp.com/docs/en/data-sheet/LM75A.pdf>
- Datasheet MCP9808 <https://ww1.microchip.com/downloads/en/DeviceDoc/25095A.pdf>
- (near C28) I2C address:
  LM75: 0x9(A2 A1 A0 W/R)
  MCP9808: 0x3(A2 A1 A0 W/R)
  MCP9808*: 0x9(A2 A1 A0 W/R)
- Datasheet SN65HVD234 <https://www.ti.com/lit/ds/symlink/sn65hvd234.pdf?ts=1611440773598>
- (near U4) Datasheet BNO055 <https://www.bosch-sensortec.com/media/boschsensortec/downloads/datasheets/bst-bno055-ds000.pdf>
- Documents <https://www.bosch-sensortec.com/products/smart-sensors/bno055.html>
- I2C address:
  ADO HIGH: 0x29
  ADO LOW: 0x28
- (in symbol 2-1971800-4) TE
- (in symbol 3-1971800-3) TE
- (in symbol 1375799-1, part A) A
- (in symbol 1375799-1, part B) B
- (in symbol 1375799-1, part C) C
- (in symbol 1375799-1, part D) D
- (in symbol CAP0603) 0603
- (in symbol CAP0805) 0805
- (in symbol CAP1206) 1206
- (in symbol IND0603) 0603
- (in symbol RBF) COM; NO; NC
- (in symbol RES0603) 0603
- (in symbol TSV994, part A) -; +
- (in symbol TSV994, part B) +; -
- (in symbol TSV994, part C) +; -
- (in symbol TSV994, part D) +; -
- (in symbol TSV994, part E) +; -

### Library data of the parts
BEAD1 = IND0603: Indutor SDM 0603
C1 C2 = CAP0805: Capacitor SDM 0805
C3-C23 C26-C32 C34-C37 = CAP0603: Capacitor SDM 0603
C24 C25 C33 C38-C40 = CAP1206: Capacitor SDM 1206
Cam1 Cam2 = RPi_Cam_V2
H1 = Header-4P: Header 4 Pinos
IC1 = STM32H750VBT6: Integrated Circuit; Manufacturer_Name: STMicroelectronics; Datasheet Link: https://www.st.com/resource/en/datasheet/stm32h750vb.pdf; Height: 1.6mm; Manufacturer_Part_Number: STM32H750VBT6; Arrow Part Number: STM32H750VBT6; Arrow Price/Stock: https://www.arrow.com/en/products/stm32h750vbt6/stmicroelectronics; Mouser Part Number: 511-STM32H750VBT6; Mouser Price/Stock: https://www.mouser.co.uk/ProductDetail/STMicroelectronics/STM32H750VBT6?qs=%252BEew9%252B0nqrBAeuu%2FsQQSzQ%3D%3D
IC2 = LM75ADP: Integrated Circuit; Manufacturer_Name: Nexperia; Datasheet Link: http://docs-emea.rs-online.com/webdocs/0b4c/0900766b80b4c8ed.pdf; Height: 1.1mm; Manufacturer_Part_Number: LM75ADP; Mouser Part Number: N/A; Mouser Price/Stock: https://www.mouser.com/Search/Refine.aspx?Keyword=N%2FA
J1 J2 = 3-1971800-3: GRACE INERTIA 2.5, PCB Mount Header, Vertical, Wire-to-Board, 3 Position, 2.5mm [.098in] Centerline, 1 Row, Tin, Red Housing Color, Shrouded
J3 J4 = 2-1971800-4: GRACE INERTIA 2.5, PCB Mount Header, Vertical, Wire-to-Board, 2 Position, 2.5mm [.098in] Centerline, 1 Row, Tin, Yellow Housing
J5 J6 = SFW15R: Camera Raspberry Pi connector / 15 Pos; Manufacturer_Name: Amphenol; Datasheet Link: https://componentsearchengine.com/Datasheets/1/SFW15R-1STE1LF.pdf; Height: 2.7mm; Manufacturer_Part_Number: SFW15R-1STE1LF; Mouser Part Number: 649-SFW15R-1STE1LF; Mouser Price/Stock: https://www.mouser.co.uk/ProductDetail/Amphenol-FCI/SFW15R-1STE1LF/?qs=XRaITl65jnv68s03BNJRSQ%3D%3D; Arrow Part Number: SFW15R-1STE1LF; Arrow Price/Stock: https://www.arrow.com/en/products/sfw15r-1ste1lf/amphenol-fci
J7-J14 R1-R50 = RES0603: Resistor SMD 0603
LDO1 = TL1963A-33DCYR: Power Supply; Manufacturer_Name: Texas Instruments; Datasheet Link: http://www.ti.com/lit/gpn/tl1963a; Height: 1.8mm; Manufacturer_Part_Number: TL1963A-33DCYR; Arrow Part Number: TL1963A-33DCYR; Arrow Price/Stock: https://www.arrow.com/en/products/tl1963a-33dcyr/texas-instruments; Mouser Part Number: 595-TL1963A-33DCYR; Mouser Price/Stock: https://www.mouser.co.uk/ProductDetail/Texas-Instruments/TL1963A-33DCYR?qs=IK5e5L0zOXhRu%2FNTAfJNEA%3D%3D
M1-M4 = W25Q128JVSIQ_TR: Inductor; Manufacturer_Name: Winbond; Manufacturer_Part_Number: W25Q128JVSIQ TR; Datasheet Link: http://www.winbond.com/resource-files/w25q128jv%20spi%20revc%2011162016.pdf; Height: 1.95mm; Arrow Part Number: W25Q128JVSIQ TR; Arrow Price/Stock: https://www.arrow.com/en/products/w25q128jvsiqtr/winbond-electronics; Mouser Part Number: 454-W25Q128JVSIQTR; Mouser Price/Stock: https://www.mouser.co.uk/ProductDetail/Winbond/W25Q128JVSIQ-TR?qs=qSfuJ%252Bfl%2Fd7vTyLA9kNdGw%3D%3D
M5 = 24LC04BT-I_SN: Integrated Circuit; Manufacturer_Name: Microchip; Manufacturer_Part_Number: 24LC04BT-I/SN; Datasheet Link: http://ww1.microchip.com/downloads/en/DeviceDoc/21708G.pdf; Height: 1.75mm; Arrow Part Number: 24LC04BT-I/SN; Arrow Price/Stock: https://www.arrow.com/en/products/24lc04bt-isn/microchip-technology; Mouser Part Number: 579-24LC04BT-I/SN; Mouser Price/Stock: https://www.mouser.co.uk/ProductDetail/Microchip-Technology/24LC04BT-I-SN?qs=C%252BuF95oynlkH1rHYRC6xpQ%3D%3D
PC/104 = 1375799-1: AMPMODU PC/104, PC/104 Connectors, Board-to-Board, 120 Position, 2mm [.079in] Centerline, Printed Circuit Board, 3A Contact Current Rating (Max)
Q1-Q3 = IRLML6401: P-Channel MOSFET / Vds: -12V / Id: -4.3A / V(GS)th: -0.95 max
Q4 Q5 = Si2312: N-Channel MOSFET / Vds: 20V / Id: 3.1A, 5sec: 5A / Vth: 0.85 max
RBF = RBF
RPi = Raspberry_CM3
S1 = Header-3P: Header 3 Pinos
U1 U2 = TSV994: Rail-to-rail input/output 20 MHz GBP operational amplifiers; Manufacturer_Name: STMicroelectronics; Datasheet Link: http://www.st.com/st-web-ui/static/active/en/resource/technical/document/datasheet/CD00144611.pdf; Height: 1.2mm; Manufacturer_Part_Number: TSV994AIPT; Mouser Part Number: 511-TSV994AIPT; Mouser Price/Stock: https://www.mouser.co.uk/ProductDetail/STMicroelectronics/TSV994AIPT/?qs=Djavi1aLnwoYgszHfckxOw%3D%3D; Arrow Part Number: TSV994AIPT; Arrow Price/Stock: https://www.arrow.com/en/products/tsv994aipt/stmicroelectronics
U3 = NUP2105L: Par de diodos protetores da CAN
U4 U5 = BNO055_M: Smart sensor combining accelerometer, gyroscope, magnetometer and orientation software. Euler angles, quaternion, rotation vector, etc.
U6 = SN65HVD234: 3.3-V Automotive CAN Bus Transceivers
USB = USB-Micro
Y1 = ECS-3225MV-250-BN-TR: Crystal or Oscillator; Manufacturer_Name: ECS; Datasheet Link: https://componentsearchengine.com/Datasheets/1/ECS-3225MV-250-BN-TR.pdf; Height: 1.2mm; Manufacturer_Part_Number: ECS-3225MV-250-BN-TR; Arrow Part Number: ECS-3225MV-250-BN-TR; Arrow Price/Stock: https://www.arrow.com/en/products/ecs-3225mv-250-bn-tr/ecs-international; Mouser Part Number: 520-3225MV-250-BNT; Mouser Price/Stock: https://www.mouser.co.uk/ProductDetail/ECS/ECS-3225MV-250-BN-TR?qs=qSfuJ%252Bfl%2Fd73PYo4tF1NlA%3D%3D